# Altium schematic sheet Ethernet.SchDoc
size A3
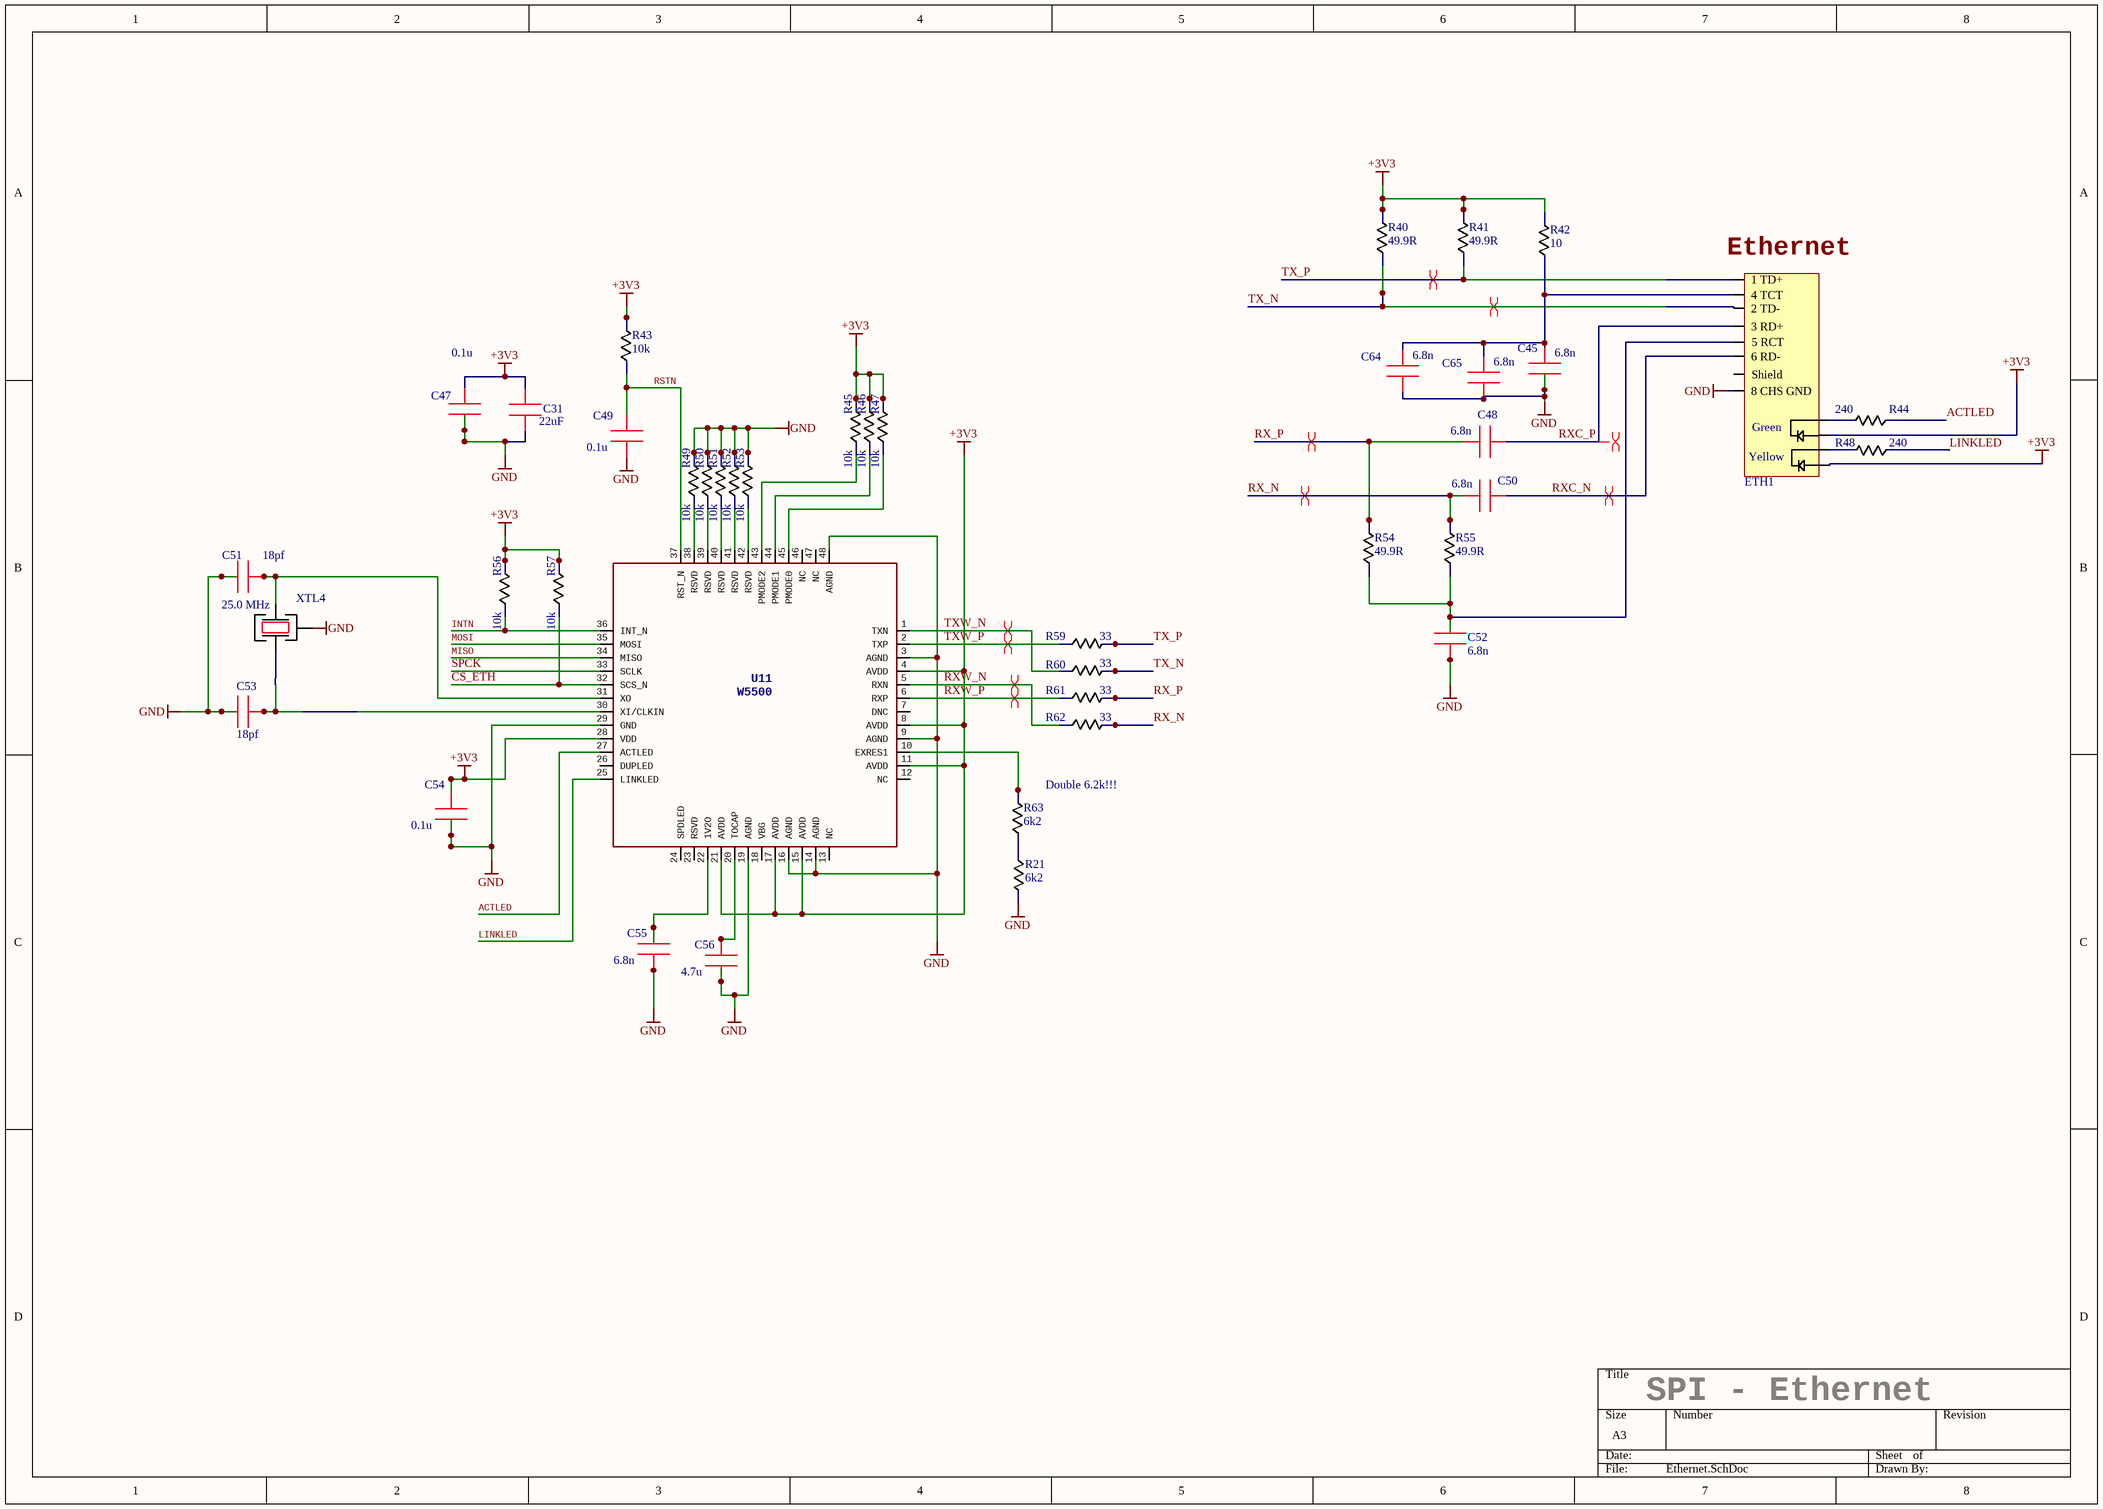
[diagram p0: Ethernet.SchDoc]

## Parts
C31  22uF  [CAP CER 1210 NP]
C45  6.8n  [0603 CAP]
C47  0.1u  [0603 CAP]
C48  6.8n  [0603 CAP]
C49  0.1u  [0603 CAP]
C50  6.8n  [0603 CAP]
C51  18pf  [0603 CAP]
C52  6.8n  [0603 CAP]
C53  18pf  [0603 CAP]
C54  0.1u  [0603 CAP]
C55  6.8n  [0603 CAP]
C56  4.7u  [0603 CAP]
C64  6.8n  [0603 CAP]
C65  6.8n  [0603 CAP]
ETH1  ETH?  [J011D21BNL]  (value not drawn)
R21  6k2  [0603 - RES]
R40  49.9R  [0603 - RES]
R41  49.9R  [0603 - RES]
R42  10  [0603 - RES]
R43  10k  [0603 - RES]
R44  240  [0603 - RES]
R45  10k  [0603 - RES]
R46  10k  [0603 - RES]
R47  10k  [0603 - RES]
R48  240  [0603 - RES]
R49  10k  [0603 - RES]
R50  10k  [0603 - RES]
R51  10k  [0603 - RES]
R52  10k  [0603 - RES]
R53  10k  [0603 - RES]
R54  49.9R  [0603 - RES]
R55  49.9R  [0603 - RES]
R56  10k  [0603 - RES]
R57  10k  [0603 - RES]
R59  33  [0603 - RES]
R60  33  [0603 - RES]
R61  33  [0603 - RES]
R62  33  [0603 - RES]
R63  6k2  [0603 - RES]
U11  W5500  [LQFP 48]
XTL4  25.0 MHz  [XTAL KX-7T]

## Nets
+3V3: C31.2 C47.1 C54.1 ETH1.9(LDGr) ETH1.12(LDYE) R40.2 R41.2 R42.2 R43.2 R45.2 R46.2 R47.2 R56.2 R57.2 U11.4(AVDD) U11.8(AVDD) U11.11(AVDD) U11.15(AVDD) U11.17(AVDD) U11.21(AVDD) U11.28(VDD)
GND: C31.1 C45.2 C47.2 C49.2 C51.1 C52.2 C53.1 C54.2 C55.2 C56.2 C64.2 C65.2 ETH1.8(8_CHS_GND) R21.2 R49.2 R50.2 R51.2 R52.2 R53.2 U11.3(AGND) U11.9(AGND) U11.14(AGND) U11.16(AGND) U11.19(AGND) U11.29(GND) U11.48(AGND) XTL4.2
ACTLED: R44.1 U11.27(ACTLED)
CS_ETH: R57.1 U11.32(SCS_N)
INTN: R56.1 U11.36(INT_N)
LINKLED: R48.1 U11.25(LINKLED)
MISO: U11.34(MISO)
MOSI: U11.35(MOSI)
RSTN: C49.1 R43.1 U11.37(RST_N)
RX_N: C50.1 R55.2 R62.2
RX_P: C48.1 R54.2 R61.2
RXC_N: C50.2 ETH1.6(6_RD-)
RXC_P: C48.2 ETH1.3(3_RD+)
RXW_N: R62.1 U11.5(RXN)
RXW_P: R61.1 U11.6(RXP)
SPCK: U11.33(SCLK)
TX_N: ETH1.2(2_TD-) R40.1 R60.2
TX_P: ETH1.1(1_TD+) R41.1 R59.2
TXW_N: R60.1 U11.1(TXN)
TXW_P: R59.1 U11.2(TXP)
NetC45_1: C45.1 C64.1 C65.1 ETH1.4(4_TCT) R42.1
NetC51_2: C51.2 U11.31(XO) XTL4.3
NetC52_1: C52.1 ETH1.5(5_RCT) R54.1 R55.1
NetC53_2: C53.2 U11.30(XI/CLKIN) XTL4.1
NetC55_1: C55.1 U11.22(1V2O)
NetC56_1: C56.1 U11.20(TOCAP)
NetETH1_10: ETH1.10(LDGr) R44.2
NetETH1_11: ETH1.11(LDYE) R48.2
NetR21_1: R21.1 R63.1
NetR45_1: R45.1 U11.43(PMODE2)
NetR46_1: R46.1 U11.44(PMODE1)
NetR47_1: R47.1 U11.45(PMODE0)
NetR49_1: R49.1 U11.38(RSVD)
NetR50_1: R50.1 U11.39(RSVD)
NetR51_1: R51.1 U11.40(RSVD)
NetR52_1: R52.1 U11.41(RSVD)
NetR53_1: R53.1 U11.42(RSVD)
NetR63_2: R63.2 U11.10(EXRES1)

Not connected (* = marked no-connect by the designer): ETH1 SHIELD(Shield); U11 7(DNC) 12(NC) 13(NC) 18(VBG) 23(RSVD) 24(SPDLED) 26(DUPLED) 46(NC) 47(NC)

## Layout directives
differential pair: RX_N, RX_P, RXC_N, RXC_P, RXW_N, RXW_P, TX_N, TX_P, TXW_N, TXW_P

## Notes on the sheet
- (near ETH1) Ethernet
- (near R63) Double 6.2k!!!
- SPI - Ethernet
- (in symbol J0011D21BNL) Green; Yellow

## Library data of the parts
C31 = 0805 Cap: CC1210KKX5R7BB226
C45 C64 C65 = 0603 CAP: GRM188R71H223KA01D
C47 C49 C54 = 0603 CAP: GRM188R71E104KA01D
C48 C50 = 0603 CAP: CC0603KRX7R9BB682
C51 C53 = 0603 CAP: GRM1885C1H180JA01D
C52 C55 = 0603 CAP
C56 = 0603 CAP: GRM188R61A475KE15D
ETH1 = J0011D21BNL
R21 = Resistor 0805: 0805 SMD Resistor
R40 R41 R54 R55 = 0603 RES: RC0603FR-0749R9
R42 R44 R48 = 0603 RES: CRCW060310R0FKEA
R43 R45-R47 R49-R53 R56 R57 = 0603 RES: RC0603JR-0710K
R59-R62 = 0603 RES: RC0603FR-0733R
R63 = 0603 RES: RC0603FR-076K2
XTL4 = KX-7: Geyer KX-7 25.0 MHz